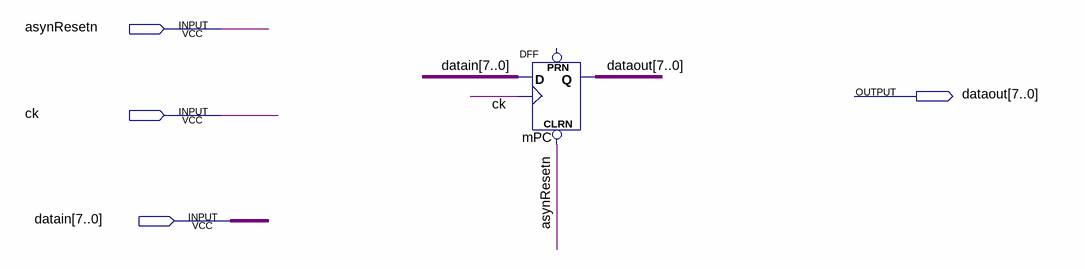
[diagram p0: schematic sheet]
// Quartus schematic microPC.bdf as structural Verilog: 1 symbols, 4 pins
module microPC (
  input  asynResetn,
  input  ck,
  input  [7:0] datain,
  output [7:0] dataout
);

  DFF mPC[7:0] (.CLRN(asynResetn), .CLK(ck), .D(datain), .Q(dataout));  // open: PRN
endmodule
